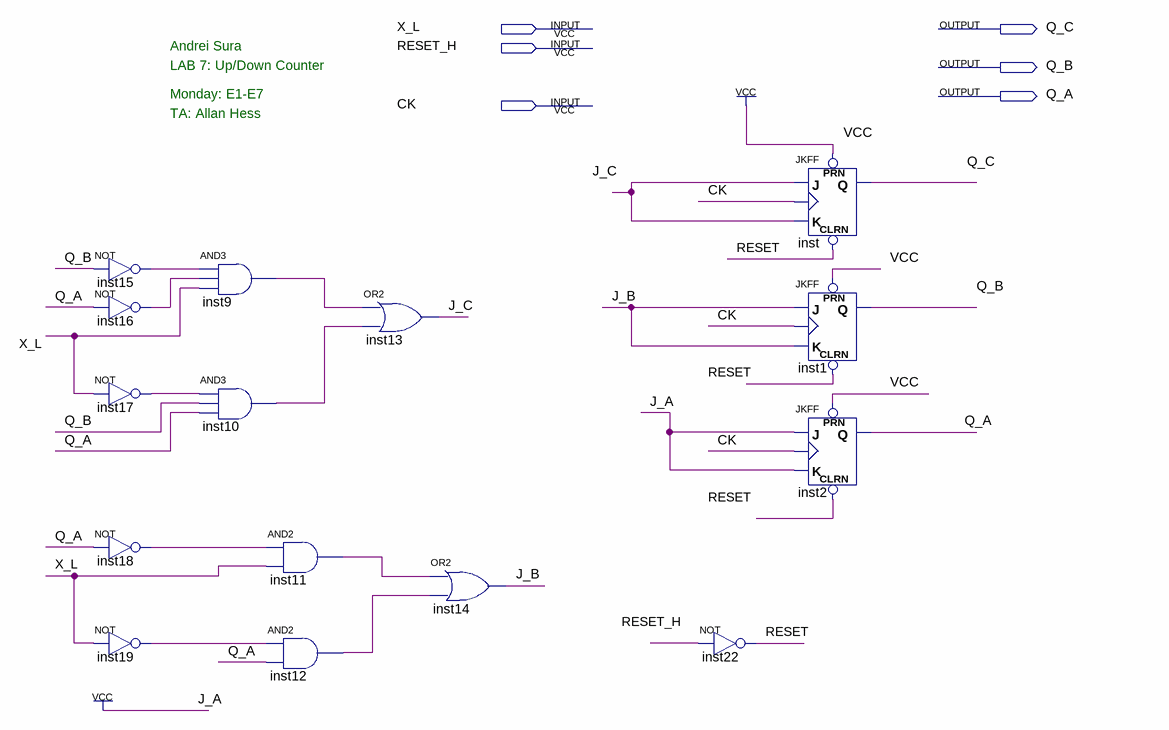
[diagram p0: schematic sheet]
// Quartus schematic lab_7_counter.bdf as structural Verilog: 15 symbols, 6 pins
module lab_7_counter (
  input  X_L,
  input  RESET_H,
  input  CK,
  output Q_C,
  output Q_B,
  output Q_A
);

  wire inst9_out, inst10_out, inst11_out, inst12_out, inst15_out, inst16_out, inst17_out, inst18_out,
       inst19_out, J_B, J_C, RESET;

  not inst15 (inst15_out, Q_B);
  not inst16 (inst16_out, Q_A);
  not inst17 (inst17_out, X_L);
  not inst18 (inst18_out, Q_A);
  not inst19 (inst19_out, X_L);
  and inst9 (inst9_out, inst15_out, inst16_out, X_L);
  and inst10 (inst10_out, inst17_out, Q_B, Q_A);
  and inst11 (inst11_out, inst18_out, X_L);
  and inst12 (inst12_out, inst19_out, Q_A);
  or inst13 (J_C, inst9_out, inst10_out);
  or inst14 (J_B, inst11_out, inst12_out);
  not inst22 (RESET, RESET_H);
  JKFF inst (.PRN(1'b1), .CLRN(RESET), .K(J_C), .J(J_C), .CLK(CK), .Q(Q_C));
  JKFF inst1 (.PRN(1'b1), .CLRN(RESET), .K(J_B), .J(J_B), .CLK(CK), .Q(Q_B));
  JKFF inst2 (.PRN(1'b1), .CLRN(RESET), .K(1'b1), .J(1'b1), .CLK(CK), .Q(Q_A));

  // Notes on the sheet:
  //   Andrei Sura
  //   LAB 7: Up/Down Counter
  //   Monday: E1-E7
  //   TA: Allan Hess
endmodule
